# Altium schematic sheet gaussmeter_and_temp.SchDoc: Hall / Hub Board / Gaussm. + Temp
size A4; DocumentNumber: 4; SheetNumber: 4; SheetTotal: 7
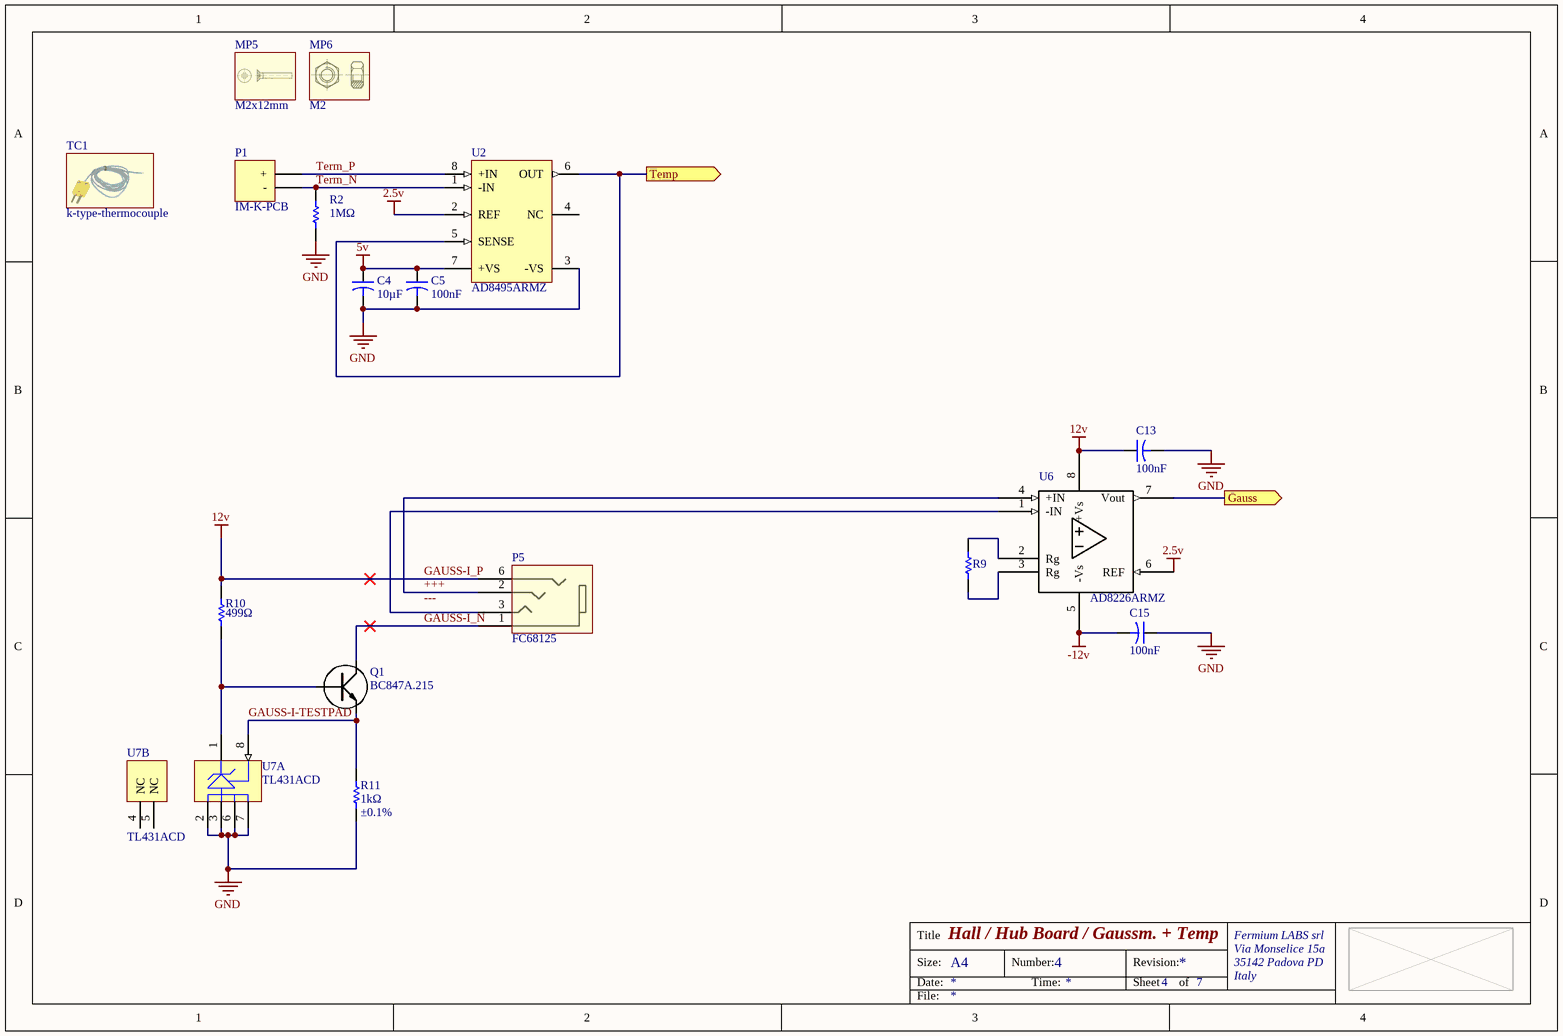
[diagram p0: gaussmeter_and_temp.SchDoc]

## Parts
C4  Capacitance: 10µF  [CAP 1206/3216]
C5  Capacitance: 100nF  [CAP 0805/2012]
C13  Capacitance: 100nF  [CAP 0805/2012]
C15  Capacitance: 100nF  [CAP 0805/2012]
MP5  Size: M2x12mm  (hidden comment: screw-M2x12mm)  (mechanical)
MP6  Size: M2  (hidden comment: nut-M2)  (mechanical)
P1  (no value)  [IM-K-PCB]
P5  (no value)  [FC68125]
Q1  Supplier Part Number 1: BC847A.215  [SOT23-BCE]
R2  Resistance: 1MΩ  [RES 0805/2012]
R9  (no value)  [RES 0805/2012]  (no BOM)
R10  Resistance: 499Ω  [RES 0805/2012]
R11  Resistance: 1kΩ  Tolerance: ±0.1%  [RES 0805/2012]
TC1  k-type-thermocouple  (mechanical)
U2  Manufacturer Part Number: AD8495ARMZ  [ADI-RM-8_N]
U6  Manufacturer Part Number: AD8226ARMZ  [MSOP_MO-187-AA AD8220]
U7  (no value)  [TI-D8_N]  (parts A,B of 2)

## Ports
Gauss (out), Temp (out)

## Nets
2.5v: U2.2(REF) U6.6(REF)
5v: C4.1 C5.1 U2.7(+VS)
-12v: C15.2 U6.5(-Vs)
GAUSS-I_P: C13.1 P5.6 R10.1 U6.8(+Vs)  [also labelled 12v]
GND: C4.2 C5.2 C13.2 C15.1 R2.2 R11.2 U2.3(-VS) U7.2(ANODE) U7.3(ANAODE) U7.6(ANODE) U7.7(ANODE)
+++: P5.2 U6.4(+IN)
Gauss: U6.7(Vout) ; port Gauss
GAUSS-I-TESTPAD: Q1.E R11.1 U7.8(REF)
GAUSS-I_N: P5.1 Q1.C
Temp: U2.5(SENSE) U2.6(OUT) ; port Temp
Term_N: P1.- R2.1 U2.1(-IN)
Term_P: P1.+ U2.8(+IN)
NetP5_3: P5.3 U6.1(-IN)
NetQ1_B: Q1.B R10.2 U7.1(CATHODE)
NetR9_1: R9.1 U6.2(Rg)
NetR9_2: R9.2 U6.3(Rg)

Not connected (* = marked no-connect by the designer): U2 4(NC); U7 4(NC) 5(NC)

## Notes on the sheet
- Labels drawn without touching a wire or pin: ---
- Title
- Size:
- Date:
- A4
- Number:
- Time:
- Revision:
- Sheet
- of
- Fermium LABS srl
- Via Monselice 15a
- 35142 Padova PD
- Italy
- File:

## Library data of the parts
C4 = Cap2: Capacitor; Manufacturer: SAMSUNG; Manufacturer Part Number: CL31A106KAHNNNE; Unit: pcs; SuppliedAmount: 0; MinAmount: 100; Capacitor type: ceramic; Capacitor kind: MLCC; Operating voltage: 25V; Dielectric: X5R; Tolerance: ±10%; Case - inch: 1206; Case - mm: 3216; Pads: 2 SMD; Published: 23-Sep-2002; PackageReference: CAPR5-4X5; Publisher: Altium Limited; PackageDescription: 1206; Supplier 1: TME; Supplier Part Number 1: CL31A106KAHNNNE; Category: 1206 MLCC SMD Capacitors; Stock 1: 279700; Pricing 1: 100=0.0248, 300=0.0203, 1000=0.0167, 2000=0.0131, 10000=0.0127 (EUR); Weight: 0.061; Multiples: 100; Mounting: SMD; Operating temperature: -55...85°C; Price Type: NET; ComponentLink1URL: http://static.tme.eu/products_pics/b/e/9/be9e0dd298dcf4979ea1dd3d226e0bfa/58780.jpg; ComponentLink1Description: http://static.tme.eu/products_pics/b/e/9/be9e0dd298dcf4979ea1dd3d226e0bfa/58780.jpg
C5 C13 C15 = Cap2: Capacitor; Manufacturer: YAGEO; Manufacturer Part Number: CC0805JRX7R9BB104; Unit: pcs; SuppliedAmount: 0; MinAmount: 100; Capacitor type: ceramic; Capacitor kind: MLCC; Operating voltage: 50V; Dielectric: X7R; Tolerance: ±5%; Case - inch: 0805; Case - mm: 2012; Pads: 2 SMD; Supplier 1: TME; Supplier Part Number 1: CC0805JRX7R9104; Category: 0805 MLCC SMD Capacitors; Stock 1: 89911; Pricing 1: 100=0.00613, 300=0.00464, 1000=0.00342, 4000=0.00284, 20000=0.00273 (EUR); Weight: 0.042; Multiples: 100; Mounting: SMD; Price Type: NET; ComponentLink1URL: http://static.tme.eu/products_pics/d/b/b/dbbd93eaf25225110ca26eb66da77328/58538.jpg; ComponentLink1Description: http://static.tme.eu/products_pics/d/b/b/dbbd93eaf25225110ca26eb66da77328/58538.jpg
MP5 = screw-M2x12mm: Manufacturer Part Number: M2X12/D965; Manufacturer: KRAFTBERG; Supplier 1: TME; Supplier Part Number 1: M2X12/D965
MP6 = nut-M2: Manufacturer Part Number: M2/D934-A2; Manufacturer: KRAFTBERG; Supplier 1: TME; Supplier Part Number 1: M2/D934-A2
P1 = Header 2: K thermocouple connector; Manufacturer: LABFACILITY; Pads: 2 THT; Supplier 1: Farnell; Supplier Part Number 1: 3810628; Manufacturer Part Number: IM-K-PCB
P5 = FC68125: Manufacturer: CLIFF; Unit: pcs; SuppliedAmount: 0; MinAmount: 2; Multiples: 1; Connector: socket; Connector type: Jack 3,5mm; Number of ways: 4; Electrical mounting: THT; Pads: 5 THT; Supplier 1: TME; Supplier Part Number 1: FC68125; Manufacturer Part Number: FC68125; Category: Jack connectors; Stock 1: 1312; Pricing 1: 2=0.41, 20=0.37, 100=0.33, 500=0.28 (USD); Weight: 0.942; Width: 7.1mm; Height: 6mm; Depth: 15.1mm; Price Type: NET; ComponentLink1URL: http://static.tme.eu/products_pics/9/3/a/93a060f269bb569398921100f84c519a/360179.jpg; ComponentLink1Description: http://static.tme.eu/products_pics/9/3/a/93a060f269bb569398921100f84c519a/360179.jpg
Q1 = BC847: NPN TRANSISTOR; Manufacturer: NXP; Unit: pcs; SuppliedAmount: 0; MinAmount: 25; Multiples: 1; Polarisation: bipolar; Collector-emitter voltage: 50V; Collector current: 100mA; Pads: 3 SMD; Supplier 1: TME; Manufacturer Part Number: BC847A.215; Category: NPN SMD Transistors; Stock 1: 12409; Pricing 1: 25=0.0184, 100=0.0119, 500=0.0101, 3000=0.00834, 12000=0.00776 (EUR); Weight: 0.036; Transistor type: NPN; Case: SOT23; Mounting: SMD; Quantity in package: 3000pcs.; Package type: reel; Price Type: NET; ComponentLink1URL: http://static.tme.eu/products_pics/b/2/d/b2d52d61b89775d5a69a2709edebf449/322489.jpg; ComponentLink1Description: http://static.tme.eu/products_pics/b/2/d/b2d52d61b89775d5a69a2709edebf449/322489.jpg
R2 = Res1: Resistor; Manufacturer: ROYAL OHM; Manufacturer Part Number: 0805S8J0105T5E; Unit: pcs; SuppliedAmount: 0; MinAmount: 100; Case - inch: 0805; Case - mm: 2012; Power: 0.125W; Tolerance: ±5%; Max. operating voltage: 150V; Max. overload voltage: 300V; Temperature coefficient: 100ppm/°C; Pads: 2 SMD; Published: 8-Jun-2000; LatestRevisionDate: 17-Jul-2002; LatestRevisionNote: Re-released for DXP Platform.; PackageReference: AXIAL-0.3; Publisher: Altium Limited; PackageDescription: Axial Device, Thru-Hole; 2 Leads; 0.3 in Pin Spacing; Supplier 1: TME; Supplier Part Number 1: SMD0805-1M; Category: 0805 SMD Resistors; Stock 1: 9400; Pricing 1: 100=0.00616, 1000=0.00237, 5000=0.00081, 15000=0.00077, 50000=0.00074 (EUR); Weight: 0.031; Multiples: 100; Resistor type: thick film; Mounting: SMD; Operating temperature: -55...125°C; Price Type: NET; ComponentLink1URL: http://static.tme.eu/products_pics/a/3/4/a34f7a182e69d69fdfdb65c44b99ca64/60560.jpg; ComponentLink1Description: http://static.tme.eu/products_pics/a/3/4/a34f7a182e69d69fdfdb65c44b99ca64/60560.jpg
R9 = Res1: Resistor; Pads: N/A
R10 = Res1: Resistor; Manufacturer: ROYAL OHM; Manufacturer Part Number: TC0525B4990T1E; Unit: pcs; SuppliedAmount: 0; MinAmount: 10; Kind of resistor: precise; Case - inch: 0805; Case - mm: 2012; Power: 100mW; Tolerance: ±0.1%; Max. operating voltage: 100V; Max. overload voltage: 200V; Temperature coefficient: 25ppm/°C; Pads: 2 SMD; Supplier 1: TME; Supplier Part Number 1: TC0525B4990T1E; Category: 0805 SMD Precision Resistors; Stock 1: 1880; Pricing 1: 10=0.11377, 50=0.08438, 250=0.06352, 1000=0.05404 (EUR); Weight: 0.079; Multiples: 10; Resistor type: thin film; Mounting: SMD; Price Type: NET; ComponentLink1URL: http://static.tme.eu/products_pics/9/f/6/9f65441075116f8118ec43255d000045/56542.jpg; ComponentLink1Description: http://static.tme.eu/products_pics/9/f/6/9f65441075116f8118ec43255d000045/56542.jpg
R11 = Res1: Resistor; Manufacturer: VIKING; Manufacturer Part Number: AR05BTCW1001; Manufacturer series: AR; Unit: pcs; SuppliedAmount: 0; MinAmount: 10; Kind of resistor: precise; Case - inch: 0805; Case - mm: 2012; Power: 0.125W; Max. operating voltage: 150V; Max. overload voltage: 300V; Temperature coefficient: 25ppm/°C; Pads: 2 SMD; Published: 8-Jun-2000; LatestRevisionDate: 17-Jul-2002; LatestRevisionNote: Re-released for DXP Platform.; PackageReference: AXIAL-0.3; Publisher: Altium Limited; PackageDescription: Axial Device, Thru-Hole; 2 Leads; 0.3 in Pin Spacing; Supplier 1: TME; Supplier Part Number 1: AR0805-1K-0.1%; Category: 0805 SMD Precision Resistors; Stock 1: 0; Pricing 1: 10=0.11211, 100=0.05707, 1000=0.03771, 5000=0.03176 (EUR); Weight: 0.034; Multiples: 10; Resistor type: thin film; Mounting: SMD; Operating temperature: -55...155°C; Price Type: NET; ComponentLink1URL: http://static.tme.eu/products_pics/6/6/c/66cc5cd64257edd80ca8e9fd2040972d/56038.jpg; ComponentLink1Description: http://static.tme.eu/products_pics/6/6/c/66cc5cd64257edd80ca8e9fd2040972d/56038.jpg; Supplier 2: TME; Supplier Part Number 2: AR0805-1K13-0.1%; Stock 2: 750; Pricing 2: 10=0.11119, 100=0.05661, 1000=0.0374, 5000=0.0315 (EUR)
TC1 = k-type-thermocouple: Manufacturer Part Number: TP01; Supplier 1: Aliexpress; Supplier Part Number 1: TP01; Manufacturer: N/A
U2 = AD8494ARMZ: K thermocouple amplifier; Manufacturer: Analog Devices; Output Type: Analog; Interface Type: 2-wire; Operating Supply Current: 180 uA; Supply Voltage - Max: 18 V; Supply Voltage - Min: 2.7 V; Pads: 8 SMD; Supplier 1: Mouser; Supplier Part Number 1: 584-AD8495ARMZ; RoHS: RoHS Compliant; Category: Sensor Interface; Stock 1: 2392; Pricing 1: 1=4.35, 10=3.88, 25=3.49, 50=3.28, 100=3.19, 250=2.88, 500=2.56, 1000=2.25 (EUR); Package / Case: MSOP-8; Packaging: Tube; Series: AD8495; Type: Thermocouple Amplifier; Brand: Analog Devices; Mounting Style: SMD/SMT; Maximum Operating Temperature: + 125 C; Minimum Operating Temperature: - 40 C; Standard Pack Qty: 50; RoHS - Mouser: Y; Minimum Order Quantity: 1; Reeling: False; ComponentLink1URL: http://www.mouser.com/ds/2/609/AD8494_8495_8496_8497-877834.pdf; ComponentLink1Description: http://www.mouser.com/ds/2/609/AD8494_8495_8496_8497-877834.pdf
U6 = AD8226: Instrumentation amplifier; Manufacturer: Analog Devices; Supply Type: Single, Dual; Number of Channels: 1 Channel; 3 dB Bandwidth: 1.5 MHz; CMRR - Common Mode Rejection Ratio: 120 dB; Dual Supply Voltage: 1.35 V to 18 V; Gain V/V: 1 V/V to 1000 V/V; Ib - Input Bias Current: 35 nA; Maximum Input Resistance: 800 MOhms at +/- 15 V; Operating Supply Current: 325 uA; Operating Supply Voltage: 2.2 V to 36 V; SR - Slew Rate: 0.4 V/us; Supply Voltage - Max: 36 V; Supply Voltage - Min: 2.2 V; Voltage Gain dB: 60 dB; Vos - Input Offset Voltage: 100 uV; Pads: 8 SMD; Supplier 1: Mouser; Supplier Part Number 1: 584-AD8226ARMZ; RoHS: RoHS Compliant; Category: Instrumentation Amplifiers; Stock 1: 679; Pricing 1: 1=2.48, 10=2.22, 25=1.99, 50=1.87, 100=1.82, 250=1.64, 500=1.47, 1000=1.28 (EUR); Amplifier Type: Instrumentation Amplifier; Height: 0.85 mm; Length: 3 mm; Package / Case: MSOP-8; Packaging: Tube; Product: Instrumentation Amplifiers; Series: AD8226; Width: 3 mm; Brand: Analog Devices; Mounting Style: SMD/SMT; GBP - Gain Bandwidth Product: -; Maximum Operating Temperature: + 125 C; Minimum Operating Temperature: - 40 C; Standard Pack Qty: 50; Vcm - Common Mode Voltage: 2.2 V to 36 V; RoHS - Mouser: Y; Minimum Order Quantity: 1; Reeling: False; ComponentLink1URL: http://www.mouser.com/ds/2/609/AD8226-877720.pdf; ComponentLink1Description: http://www.mouser.com/ds/2/609/AD8226-877720.pdf
U7 = TL431ACD: Adjustable Precision Shunt Regulator; Manufacturer: TEXAS INSTRUMENTS; Unit: pcs; SuppliedAmount: 0; MinAmount: 10; Multiples: 1; Integrated circuit type: voltage reference source; Output voltage: 2.5...36V; Pads: 6 SMD; Supplier 1: TME; Supplier Part Number 1: TL431ACD; Manufacturer Part Number: TL431ACD; Category: Reference Voltage Sources - Circuits; Stock 1: 3090; Pricing 1: 10=0.0783, 50=0.0746, 250=0.0654, 1000=0.0565, 5000=0.0517 (EUR); Weight: 0.174; Mounting: SMD; Case: SO8; Price Type: NET; ComponentLink1URL: http://static.tme.eu/products_pics/f/b/8/fb840e32b578dec2f5f44f6e02ebb846/218579.jpg; ComponentLink1Description: http://static.tme.eu/products_pics/f/b/8/fb840e32b578dec2f5f44f6e02ebb846/218579.jpg